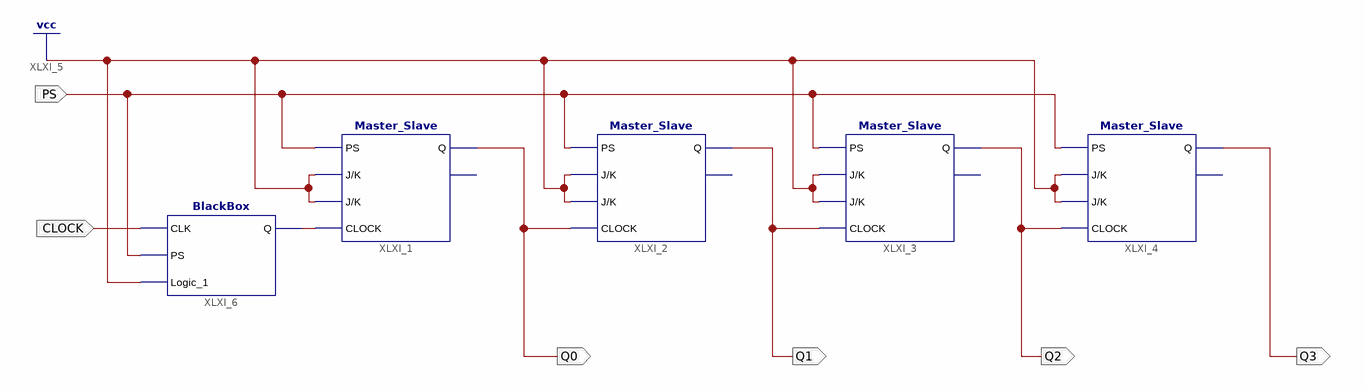
[diagram p0: schematic sheet 1]
// Xilinx ISE schematic Couter_Task.sch (artix7) as structural Verilog: 5 symbols, 6 ports
module Couter_Task (
  input  PS,
  input  CLOCK,
  output Q0,
  output Q1,
  output Q2,
  output Q3
);

  wire XLXN_14;

  Master_Slave XLXI_1 (.CLOCK(XLXN_14), .J(1'b1), .K(1'b1), .PS(PS), .Q(Q0));  // open: Qb
  Master_Slave XLXI_3 (.CLOCK(Q1), .J(1'b1), .K(1'b1), .PS(PS), .Q(Q2));  // open: Qb
  Master_Slave XLXI_4 (.CLOCK(Q2), .J(1'b1), .K(1'b1), .PS(PS), .Q(Q3));  // open: Qb
  Master_Slave XLXI_2 (.CLOCK(Q0), .J(1'b1), .K(1'b1), .PS(PS), .Q(Q1));  // open: Qb
  BlackBox XLXI_6 (.CLK(CLOCK), .Logic_1(1'b1), .PS(PS), .Q(XLXN_14));
endmodule
